# Altium schematic sheet Voltage_AC.SchDoc: Voltage AC sense
size A3; Organization: ORGANIZATION; Address1: ADDRESS 1; Address2: ADDRESS 2; Address3: ADDRESS 3; Address4: ADDRESS 4; Revision: 0.0; SheetNumber: 14; SheetTotal: 19; ENG_APP_DATE: --/--/--; DSN_APP_DATE: --/--/--; CHK_APP_DATE: --/--/--
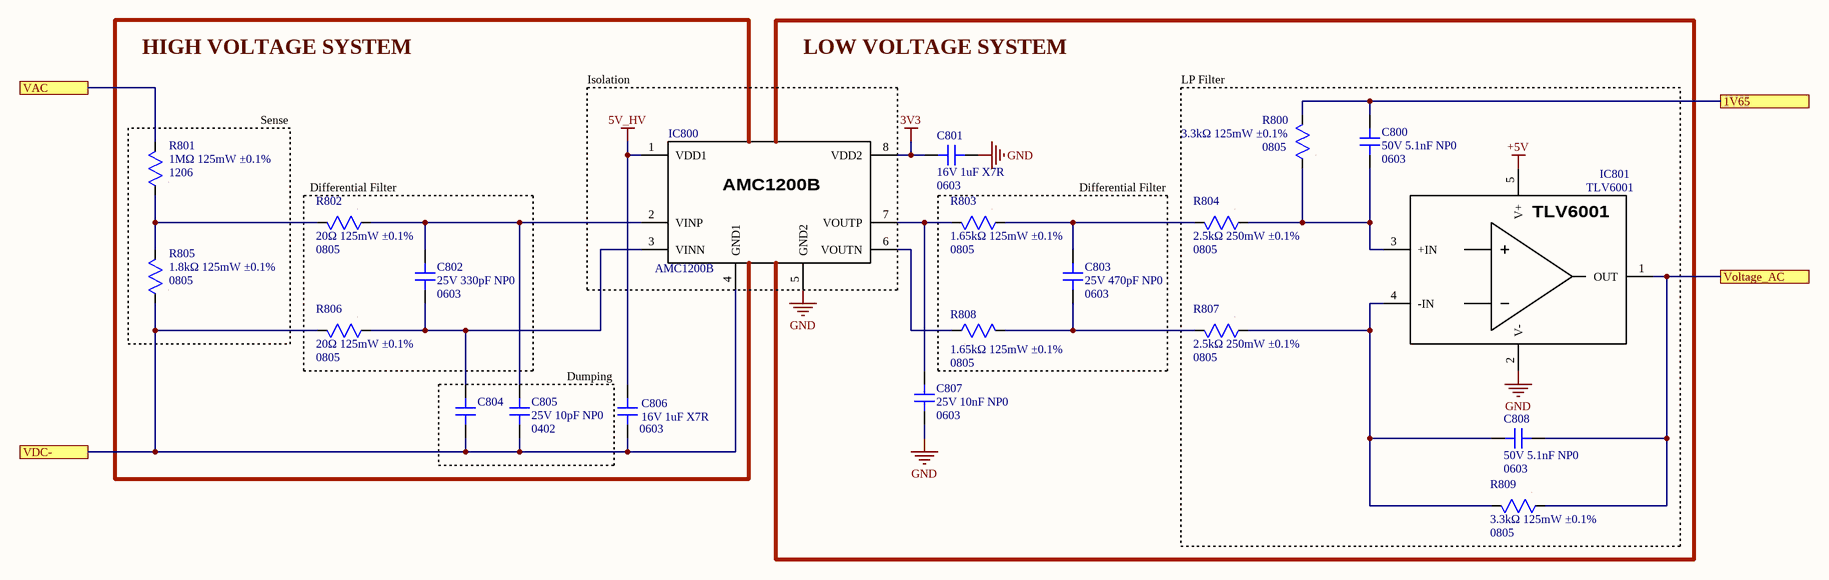
[diagram p0: Voltage_AC.SchDoc]

## Parts
C800  value 50V 5.1nF NP0  Package: 0603  [CAP SMD 0603]  (hidden comment: CAP non polarized)
C801  value 16V 1uF X7R  Package: 0603  [CAP SMD 0603]  (hidden comment: CAP non polarized)
C802  value 25V 330pF NP0  Package: 0603  [CAP SMD 0603]  (hidden comment: CAP non polarized)
C803  value 25V 470pF NP0  Package: 0603  [CAP SMD 0603]  (hidden comment: CAP non polarized)
C804  CAP non polarized  [CAP SMD 0402]  (value not drawn)
C805  value 25V 10pF NP0  Package: 0402  [CAP SMD 0402]  (hidden comment: CAP non polarized)
C806  value 16V 1uF X7R  Package: 0603  [CAP SMD 0603]  (hidden comment: CAP non polarized)
C807  value 25V 10nF NP0  Package: 0603  [CAP SMD 0603]  (hidden comment: CAP non polarized)
C808  value 50V 5.1nF NP0  Package: 0603  [CAP SMD 0603]  (hidden comment: CAP non polarized)
IC800  AMC1200B  [AMC1200B]
IC801  TLV6001  [SOT-23-5]
R800  value 3.3kΩ 125mW ±0.1%  Package: 0805  [RES SMD 0805]  (hidden comment: RES)
R801  value 1MΩ 125mW ±0.1%  Package: 1206  [RES SMD 1206]  (hidden comment: RES)
R802  value 20Ω 125mW ±0.1%  Package: 0805  [RES SMD 0805]  (hidden comment: RES)
R803  value 1.65kΩ 125mW ±0.1%  Package: 0805  [RES SMD 0805]  (hidden comment: RES)
R804  value 2.5kΩ 250mW ±0.1%  Package: 0805  [RES SMD 0805]  (hidden comment: RES)
R805  value 1.8kΩ 125mW ±0.1%  Package: 0805  [RES SMD 0805]  (hidden comment: RES)
R806  value 20Ω 125mW ±0.1%  Package: 0805  [RES SMD 0805]  (hidden comment: RES)
R807  value 2.5kΩ 250mW ±0.1%  Package: 0805  [RES SMD 0805]  (hidden comment: RES)
R808  value 1.65kΩ 125mW ±0.1%  Package: 0805  [RES SMD 0805]  (hidden comment: RES)
R809  value 3.3kΩ 125mW ±0.1%  Package: 0805  [RES SMD 0805]  (hidden comment: RES)

## Blocks framed on the sheet
Isolation: IC800
LP Filter: C800 C808 IC801 R800 R804 R807 R809
Sense: R801 R805
Differential Filter: C802 R802 R806
Differential Filter: C803 R803 R808
Dumping: C804 C805

## Ports
1V65, VAC, VDC-, Voltage_AC

## Nets
3V3: C801.1 IC800.8(VDD2)
5V_HV: C806.1 IC800.1(VDD1)
+5V: IC801.5(V+)
GND: C801.2 C807.2 IC800.5(GND2) IC801.2(V-)
1V65: C800.1 R800.2 ; port 1V65
VAC: R801.2 ; port VAC
VDC-: C804.2 C805.2 C806.2 IC800.4(GND1) R805.1 R806.2 ; port VDC-
Voltage_AC: C808.2 IC801.1(OUT) R809.1 ; port Voltage_AC
NetC800_2: C800.2 IC801.3(+IN) R800.1 R804.1
NetC802_1: C802.1 C805.1 IC800.2(VINP) R802.1
NetC802_2: C802.2 C804.1 IC800.3(VINN) R806.1
NetC803_1: C803.1 R803.1 R804.2
NetC803_2: C803.2 R807.2 R808.2
NetC807_1: C807.1 IC800.7(VOUTP) R803.2
NetC808_1: C808.1 IC801.4(-IN) R807.1 R809.2
NetIC800_6: IC800.6(VOUTN) R808.1
NetR801_1: R801.1 R802.2 R805.2

## Notes on the sheet
- HIGH VOLTAGE SYSTEM
- LOW VOLTAGE SYSTEM
- Project:
- Subsystem:
- Company:
- Document:
- Author:
- Revision:
- Date:
- Sheet:
- /

## Library data of the parts
C800 C807 C808 = 001-0109: Condensadores de cerámica multicapa (MLCC- SMD/SMT) 50V 5100pF 0603 C0G 1%; MPN: C0603C512F5GACTU; Manufacturer: KEMET; ComponentLink1Description: Datasheet; ComponentLink1URL: https://www.mouser.es/datasheet/3/72/1/C0603C512F5GACTU.pdf; ComponentLink2Description: Distributor Link; ComponentLink2URL: https://www.mouser.es/ProductDetail/KEMET/C0603C512F5GACTU?qs=Fn3VdHBzkcmgqbeAGPfrXg%3D%3D; ID: 001-0109; Distributor PN: 80-C0603C512F5G; Distributor: Mouser
C801 C806 = 001-0110: Condensadores de cerámica multicapa (MLCC- SMD/SMT) WCAP-CSGP 1uF 0603 10% 16V MLCC; MPN: 885012206052; Manufacturer: Wurth Elektronik; ComponentLink1Description: Datasheet; ComponentLink1URL: https://www.we-online.com/components/products/datasheet/885012206052.pdf; ComponentLink2Description: Distributor Link; ComponentLink2URL: https://www.mouser.es/ProductDetail/Wurth-Elektronik/885012206052?qs=0KOYDY2FL2%2F2JKabApojcQ%3D%3D; ID: 001-0110; Distributor PN: 710-885012206052; Distributor: Mouser
C802 = 001-0120: Condensadores de cerámica multicapa (MLCC- SMD/SMT) 0603 330pF 25volts C0G 1%; MPN: VJ0603A331FXXCW1BC; Manufacturer: Vishay; ComponentLink1Description: Datasheet; ComponentLink1URL: https://www.vishay.com/docs/28548/vjw1bcbascomseries.pdf; ComponentLink2Description: Distributor Link; ComponentLink2URL: https://www.mouser.es/ProductDetail/Vishay-Vitramon/VJ0603A331FXXCW1BC?qs=%2Fh0R4aLiLgPLKHvkP5P%252BKw%3D%3D; ID: 001-0120; Distributor PN: 77-VJ0603A331FXXCBC; Distributor: Mouser
C803 = 001-0108: Condensadores de cerámica multicapa (MLCC- SMD/SMT) VJ0603 HIFREQ 471 0.1 non-magnetic copper non-magnetic copper 25V unmarked 7" reel; MPN: VJ0603D471KCXAJ; Manufacturer: Vishay; ComponentLink1Description: Datasheet; ComponentLink1URL: https://www.vishay.com/docs/45258/vjhifreqseries.pdf; ComponentLink2Description: Distributor Link; ComponentLink2URL: https://www.mouser.es/ProductDetail/Vishay-Vitramon/VJ0603D471KCXAJ?qs=oomPkbqnLXekRyIlVWaYLQ%3D%3D; ID: 001-0108; Distributor PN: 77-VJ0603D471KCXAJ; Distributor: Mouser
C804 = 001-0119: Condensadores de cerámica multicapa (MLCC- SMD/SMT) 25V 10pF C0G 0402 0. 1pF; MPN: 04023A100BAT2A; Manufacturer: KYOCERA AVX; Value: 25V 10pF NP0; ComponentLink1Description: Datasheet; ComponentLink1URL: https://www.mouser.es/datasheet/3/5926/1/C0GNP0_Dielectric.pdf; ComponentLink2Description: Distributor Link; ComponentLink2URL: https://www.mouser.es/ProductDetail/KYOCERA-AVX/04023A100BAT2A?qs=Op3aA%252BNiUY5yU4vAZ7xiKg%3D%3D; Package: 0402; ID: 001-0119; Distributor PN: 581-04023A100BAT2A; Distributor: Mouser
C805 = 001-0119: Condensadores de cerámica multicapa (MLCC- SMD/SMT) 25V 10pF C0G 0402 0. 1pF; MPN: 04023A100BAT2A; Manufacturer: KYOCERA AVX; ComponentLink1Description: Datasheet; ComponentLink1URL: https://www.mouser.es/datasheet/3/5926/1/C0GNP0_Dielectric.pdf; ComponentLink2Description: Distributor Link; ComponentLink2URL: https://www.mouser.es/ProductDetail/KYOCERA-AVX/04023A100BAT2A?qs=Op3aA%252BNiUY5yU4vAZ7xiKg%3D%3D; ID: 001-0119; Distributor PN: 581-04023A100BAT2A; Distributor: Mouser
IC800 = 062-0001: Amplificadores de aislamiento 4kV peak Iso Amp A 5 95-AMC1200BDUB A 59 A 595-AMC1200BDUB; MPN: AMC1200BDUBR; Manufacturer: Texas Instruments; ID: 062-0001; ComponentLink1URL: https://www.ti.com/lit/ds/symlink/amc1200.pdf?ts=1781612882045&ref_url=https%253A%252F%252Fwww.ti.com%252Fproduct%252FAMC1200%253FkeyMatch%253DAMC1200%2526tisearch%253Duniversal_search%2526usecase%253DGPN-ALT; ComponentLink2URL: https://www.mouser.es/ProductDetail/Texas-Instruments/AMC1200BDUBR?qs=4whTb%2F0XQMjhZwrxk0lf%2FQ%3D%3D; Value: -; Package: SOP-8; Distributor PN: 595-AMC1200BDUBR; Distributor: Mouser
IC801 = 062-0002: Amplificadores operacionales - Op Amps Single 5.5-V 1-MHz R RIO operational a A A 595-TLV6001UIDBVT; MPN: TLV6001UIDBVR; Manufacturer: Texas Instruments; ID: 062-0002; ComponentLink1URL: https://www.ti.com/lit/ds/symlink/tlv6001.pdf?ts=1781607824916&ref_url=https%253A%252F%252Fcz.mouser.com%252F; ComponentLink2URL: https://www.mouser.es/ProductDetail/Texas-Instruments/TLV6001UIDBVR?qs=8N88piwwHEgntIgM8jjJ5Q%3D%3D; Value: -; Package: SOT-23-5; Distributor PN: 595-TLV6001UIDBVR; Distributor: Mouser
R800 R809 = 010-0154: Thin Film Resistors 0805 3.3Kohm 0.1% 15ppm AEC-Q200; MPN: ERA-6APB332V; Manufacturer: Panasonic; ComponentLink1Description: Datasheet; ComponentLink1URL: https://industrial.panasonic.com/cdbs/www-data/pdf/RDM0000/AOA0000C307.pdf; ComponentLink2Description: Distributor Link; ComponentLink2URL: https://www.mouser.es/ProductDetail/Panasonic/ERA-6APB332V?qs=sGAEpiMZZMvdGkrng054t7Q%2FBjLwFmgicQi9zKDLbrs%3D; ID: 010-0154; Distributor PN: 667-ERA-6APB332V; Distributor: Mouser
R801 = 010-0161: Thin Film Resistors CHIP RESISTOR Precision; MPN: CRT1206-BW-1004ELF; Manufacturer: Bourns; ComponentLink1Description: Datasheet; ComponentLink1URL: https://www.mouser.es/datasheet/3/40/1/CRT.pdf; ComponentLink2Description: Distributor Link; ComponentLink2URL: https://www.mouser.es/ProductDetail/Bourns/CRT1206-BW-1004ELF?qs=sGAEpiMZZMvdGkrng054t9uZ12tsVZVXUwFPKPuMiMw%3D; ID: 010-0161; Distributor PN: 652-CRT1206BW1004ELF; Distributor: Mouser
R802 R806 = 010-0163: Thin Film Resistors RP 2A 20R 0.1% 15PPM CUT LENGTH; MPN: RP73D2A20RBTG; Manufacturer: TE; ComponentLink1Description: Datasheet; ComponentLink1URL: https://www.te.com/commerce/DocumentDelivery/DDEController?Action=showdoc&DocId=Data+Sheet%7F1773272%7FL%7Fpdf%7FEnglish%7FENG_DS_1773272_L.pdf%7F; ComponentLink2Description: Distributor Link; ComponentLink2URL: https://www.mouser.es/ProductDetail/TE-Connectivity-Holsworthy/RP73D2A20RBTG?qs=sGAEpiMZZMvdGkrng054t9WFtWtrbdtG%2F6%2Fjgh8ECZ8%3D; ID: 010-0163; Distributor PN: 279-RP73D2A20RBTG; Distributor: Mouser
R803 R808 = 010-0153: Thin Film Resistors MCU 0805-15 0.1% P1 1K65; MPN: MCU08050E1651BP100; Manufacturer: Vishay; ComponentLink1Description: Datasheet; ComponentLink1URL: https://www.vishay.com/docs/28700/mcx0x0xpre.pdf; ComponentLink2Description: Distributor Link; ComponentLink2URL: https://www.mouser.es/ProductDetail/Vishay-Beyschlag/MCU08050E1651BP100?qs=sGAEpiMZZMvdGkrng054t2c0lhweLxbk6HRvs42FTBI%3D; ID: 010-0153; Distributor PN: 594-MCU08050E1651BP1; Distributor: Mouser
R804 R807 = 010-0165: Thin Film Resistors 2.5K OHM .1% 25PPM 1/4W; MPN: RN73R2ATTD2501B25; Manufacturer: KOA Speer; ComponentLink1Description: Datasheet; ComponentLink1URL: https://www.mouser.com/catalog/specsheets/KOA_Speer_RN73R__8_20_24.pdf?_gl=1*23gnzt*_gcl_aw*R0NMLjE3ODA5NDM2MTUuQ2owS0NRancwSm5SQmhESkFSSXNBTG9iblhiTVZmV3NWb0pqSGVpNWRkTXk2SzRuNEhwRGVRWXYxa0dMT0s1N0VWSjRWQlE1eFhBYUoxd2FBa3NuRUFMd193Y0I.*_gcl_au*MjAyMjI4Mz; ComponentLink2Description: Distributor Link; ComponentLink2URL: https://www.mouser.es/ProductDetail/KOA-Speer/RN73R2ATTD2501B25?qs=sGAEpiMZZMvdGkrng054tz3%252BeNFGeSG0078E0Mg5MLJLGvMlGbhAYw%3D%3D; ID: 010-0165; Distributor PN: 660-RN73R2ATTD2501B2; Distributor: Mouser
R805 = 010-0162: Thin Film Resistors 0805 1.8Kohm 0.1% 10ppm AEC-Q200; MPN: ERA-6ARB182V; Manufacturer: Panasonic; ComponentLink1Description: Datasheet; ComponentLink1URL: https://industrial.panasonic.com/cdbs/www-data/pdf/RDM0000/AOA0000C307.pdf; ComponentLink2Description: Distributor Link; ComponentLink2URL: https://www.mouser.es/ProductDetail/Panasonic/ERA-6ARB182V?qs=sGAEpiMZZMvdGkrng054t7Q%2FBjLwFmgiTwW2qqIgdzU%3D; ID: 010-0162; Distributor PN: 667-ERA-6ARB182V; Distributor: Mouser